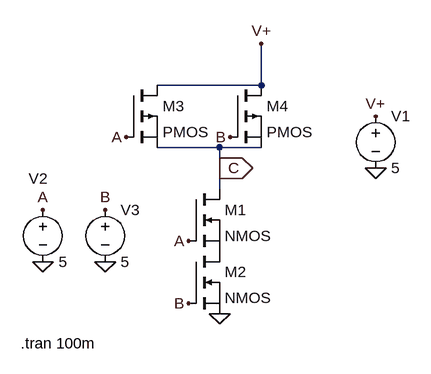
[diagram p0: schematic Draft1.asc]
Draft1.asc, the LTspice schematic file:
Version 4
SHEET 1 880 680
WIRE 208 -112 208 -176
WIRE 208 -112 48 -112
WIRE 144 -16 48 -16
WIRE 208 -16 144 -16
WIRE 144 16 144 -16
WIRE 144 48 144 16
FLAG 208 -176 V+
FLAG 144 240 0
FLAG 0 -32 A
FLAG 96 128 A
FLAG 160 -32 B
FLAG 96 224 B
FLAG -32 80 B
FLAG -128 80 A
FLAG 384 -64 V+
FLAG 384 16 0
FLAG -128 160 0
FLAG -32 160 0
FLAG 144 16 C
IOPIN 144 16 Out
SYMBOL nmos 96 48 R0
SYMATTR InstName M1
SYMBOL nmos 96 144 R0
SYMATTR InstName M2
SYMBOL pmos 0 -112 R0
SYMATTR InstName M3
SYMBOL pmos 160 -112 R0
SYMATTR InstName M4
SYMBOL voltage 384 -80 R0
WINDOW 123 0 0 Left 0
WINDOW 39 0 0 Left 0
SYMATTR InstName V1
SYMATTR Value 5
SYMBOL voltage -128 64 R0
WINDOW 0 -22 -32 Left 2
WINDOW 123 0 0 Left 0
WINDOW 39 0 0 Left 0
SYMATTR InstName V2
SYMATTR Value 5
SYMBOL voltage -32 64 R0
WINDOW 123 0 0 Left 0
WINDOW 39 0 0 Left 0
SYMATTR InstName V3
SYMATTR Value 5
TEXT -162 286 Left 2 !.tran 100m

The netlist it stands for:
* Draft1.asc
M1 C A P001 P001 NMOS
M2 P001 B 0 0 NMOS
M3 V+ A C C PMOS
M4 V+ B C C PMOS
V1 V+ 0 5
V2 A 0 5
V3 B 0 5
.model NMOS NMOS
.model PMOS PMOS
.lib standard.mos
.tran 100m
.backanno
.end

* Results of the author's LTspice run, read from the files saved beside the schematic
* Operating Point, zero values left out:
*   V(c) = 4.417 V
*   V(a) = 5 V
*   V(p001) = 1.44 V
*   V(b) = 5 V
*   V(v+) = 5 V
*   Id(M4) = 62.45 µA
*   Ib(M4) = -62.45 µA
*   Id(M3) = 62.45 µA
*   Ib(M3) = -62.45 µA
*   Id(M2) = 123.3 µA
*   Ib(M2) = -1.45 pA
*   Is(M2) = -123.3 µA
*   Id(M1) = 123.3 µA
*   Ib(M1) = -2.986 pA
*   Is(M1) = -123.3 µA
*   I(V1) = -123.3 µA